# EAGLE design Kernal64Cart (EAGLE 9.5.2)
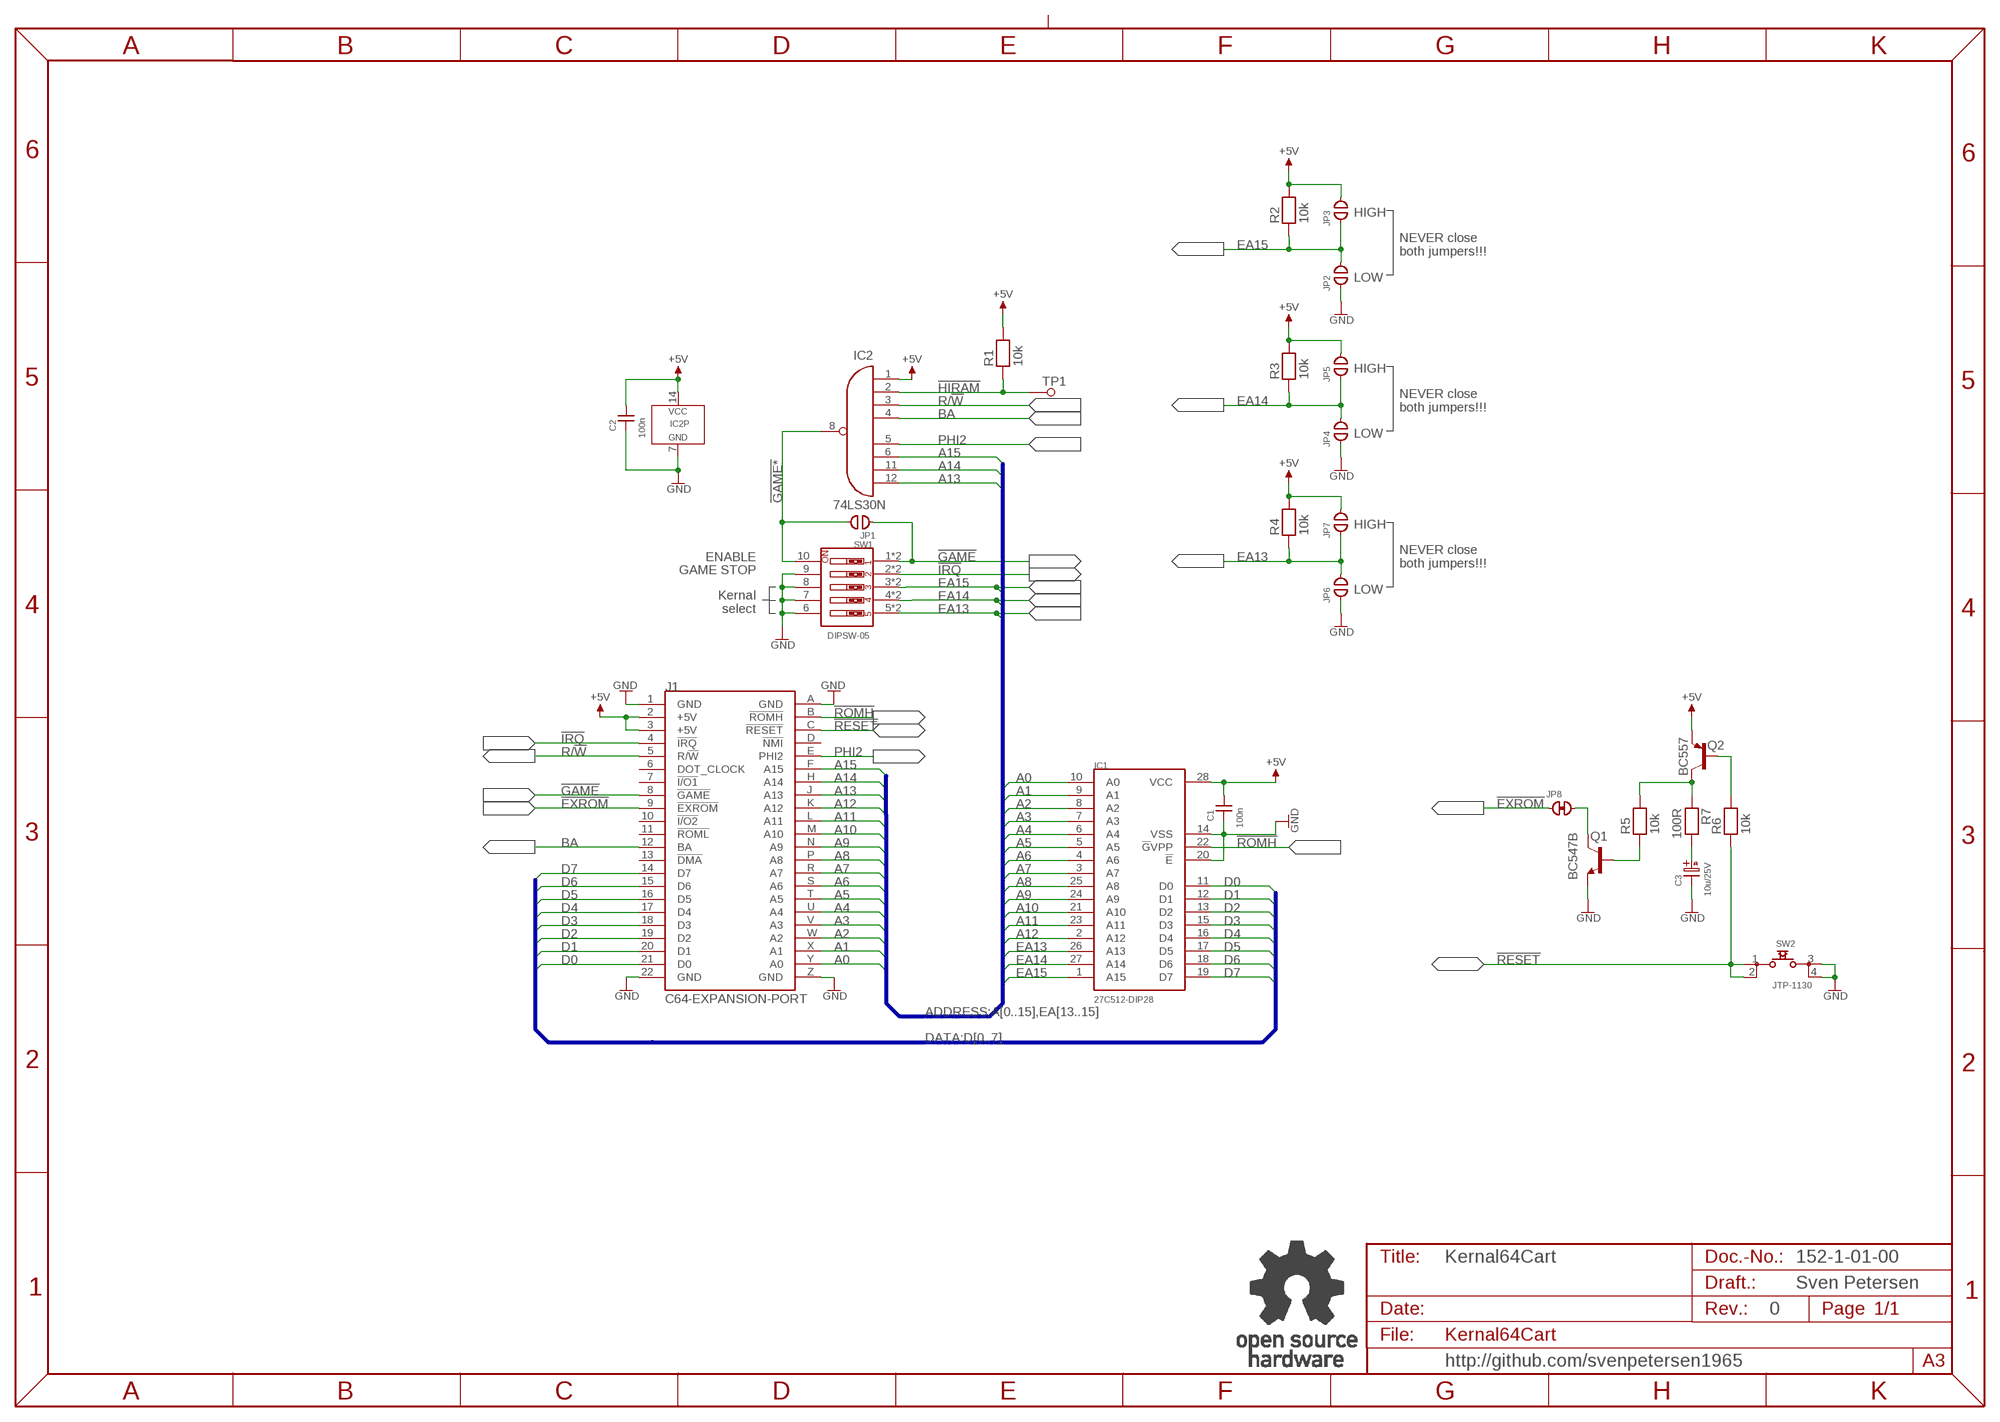
[diagram p0: schematic, sheet 1]

## Parts
C1  100n  CAP01  [C-2,5]
C2  100n  CAP01  [C-2,5]
C3  10u/25V  C05,0/2,0  [C5,0/2,0]
IC1  27C512-DIP28  M27C512-DIP28  [DIL28-6]
IC2  74LS30N  7430DIP  [DIL-14]
J1  C64-EXPANSION-PORT  C64-EXPANSIONPNARROW  [EXPANSIO_SQ]
JP1  OPEN  [CP_OP]
JP2  OPEN  [CP_OP]
JP3  OPEN  [CP_OP]
JP4  OPEN  [CP_OP]
JP5  OPEN  [CP_OP]
JP6  OPEN  [CP_OP]
JP7  OPEN  [CP_OP]
JP8  CLOSED  [CP_CL]
Q1  BC547B  [TO92]
Q2  BC557  [TO92]
R1  10k  RES04  [R-10]
R2  10k  RES04  [R-10]
R3  10k  RES04  [R-10]
R4  10k  RES04  [R-10]
R5  10k  RES04  [R-10]
R6  10k  RES04  [R-10]
R7  100R  RES04  [R-10]
SW1  DIPSW-05  [DIPSW-05VJ]
SW2  JTP-1130  [JTP-1130]
TP1  1,3/2,0  [1,3/2,0]
U$50  OPEN_SOURCE_HW  [OPENHW]

## Nets
!EXROM: J1.9(!EXROM) JP8.1
!GAME: J1.8(!GAME) JP1.1 SW1.1 SW1.1J
!GAME*: IC2.8(O) JP1.2 SW1.10
!HIRAM: IC2.2(I1) R1.1 TP1.1
!IRQ: J1.4(!IRQ) SW1.2 SW1.2J
!RESET: J1.C(!RESET) R6.1 SW2.1 SW2.2
!ROMH: IC1.22(!G!VPP) J1.B(!ROMH)
+5V: C1.2 C2.2 IC1.28(VCC) IC2.1(I0) IC2.14(VCC) J1.2(+5V) J1.3(+5V) JP3.2 JP5.2 JP7.2 Q2.1(E) R1.2 R2.2 R3.2 R4.2
A0: IC1.10(A0) J1.Y(A0)
A1: IC1.9(A1) J1.X(A1)
A2: IC1.8(A2) J1.W(A2)
A3: IC1.7(A3) J1.V(A3)
A4: IC1.6(A4) J1.U(A4)
A5: IC1.5(A5) J1.T(A5)
A6: IC1.4(A6) J1.S(A6)
A7: IC1.3(A7) J1.R(A7)
A8: IC1.25(A8) J1.P(A8)
A9: IC1.24(A9) J1.N(A9)
A10: IC1.21(A10) J1.M(A10)
A11: IC1.23(A11) J1.L(A11)
A12: IC1.2(A12) J1.K(A12)
A13: IC2.12(I7) J1.J(A13)
A14: IC2.11(I6) J1.H(A14)
A15: IC2.6(I5) J1.F(A15)
BA: IC2.4(I3) J1.12(BA)
D0: IC1.11(D0) J1.21(D0)
D1: IC1.12(D1) J1.20(D1)
D2: IC1.13(D2) J1.19(D2)
D3: IC1.15(D3) J1.18(D3)
D4: IC1.16(D4) J1.17(D4)
D5: IC1.17(D5) J1.16(D5)
D6: IC1.18(D6) J1.15(D6)
D7: IC1.19(D7) J1.14(D7)
EA13: IC1.26(A13) JP6.2 JP7.1 R4.1 SW1.5 SW1.5J
EA14: IC1.27(A14) JP4.2 JP5.1 R3.1 SW1.4 SW1.4J
EA15: IC1.1(A15) JP2.2 JP3.1 R2.1 SW1.3 SW1.3J
GND: C1.1 C2.1 C3.K(-) IC1.14(VSS) IC1.20(!E) IC2.7(GND) J1.1(GND) J1.22(GND) J1.A(GND) J1.Z(GND) JP2.1 JP4.1 JP6.1 Q1.1(E) SW1.6 SW1.7 SW1.8 SW1.9 SW2.3 SW2.4
N$1: JP8.2 Q1.3(C)
N$2: Q1.2(B) R5.1
N$3: Q2.2(B) R6.2
N$4: Q2.3(C) R5.2 R7.1
N$5: C3.A(+) R7.2
PHI2: IC2.5(I4) J1.E(PHI2)
R/!W: IC2.3(I2) J1.5(R/!W)
Unconnected: J1.6(DOT_CLOCK) J1.7(!I/O1) J1.10(!I/O2) J1.11(!ROML) J1.13(!DMA) J1.D(!NMI)

## Buses
DATA:D[0..7]
ADDRESS:A[0..15],EA[13..15]

## Notes on the sheet
- HIGH
- NEVER close
  both jumpers!!!
- LOW
- HIGH
- NEVER close
  both jumpers!!!
- LOW
- HIGH
- ENABLE
- NEVER close
  both jumpers!!!
- GAME STOP
- LOW
- Kernal
  select
- Kernal64Cart | 152-1-01-00
- Sven Petersen
- 0
- http://github.com/svenpetersen1965

## Library data of the parts
C1 C2 = DISCRETE:CAP01
C3 = ELCO:C05,0/2,0
IC1 = ST:M27C512
IC2 = 74XX:7430
J1 = Commodore:C64-EXPANSIONP
JP1-JP7 = Cutpad:OPEN: open Cutpad
JP8 = Cutpad:CLOSED: Closed Cutpad
Q1 = Transistoren:BC547*: NPN Transistor
Q2 = Transistoren:BC557: PNP Transistor
R1-R7 = DISCRETE:RES04
SW1 = DIPSWITCH:DIPSW-05
SW2 = Namae_Electronics:JTP-1130
TP1 = Pads:1,3/2,0: Testpunkt Typ: 13.70.635 Hersteller: Ettinger Technologie: Einpresstechnik Bauform: - erzeugt von: C. Zellner am: 13.3.2015 letzte Änderung: - Eagle-Version: 6.5.0
U$50 = Logo:OPEN_SOURCE_HW

## Board
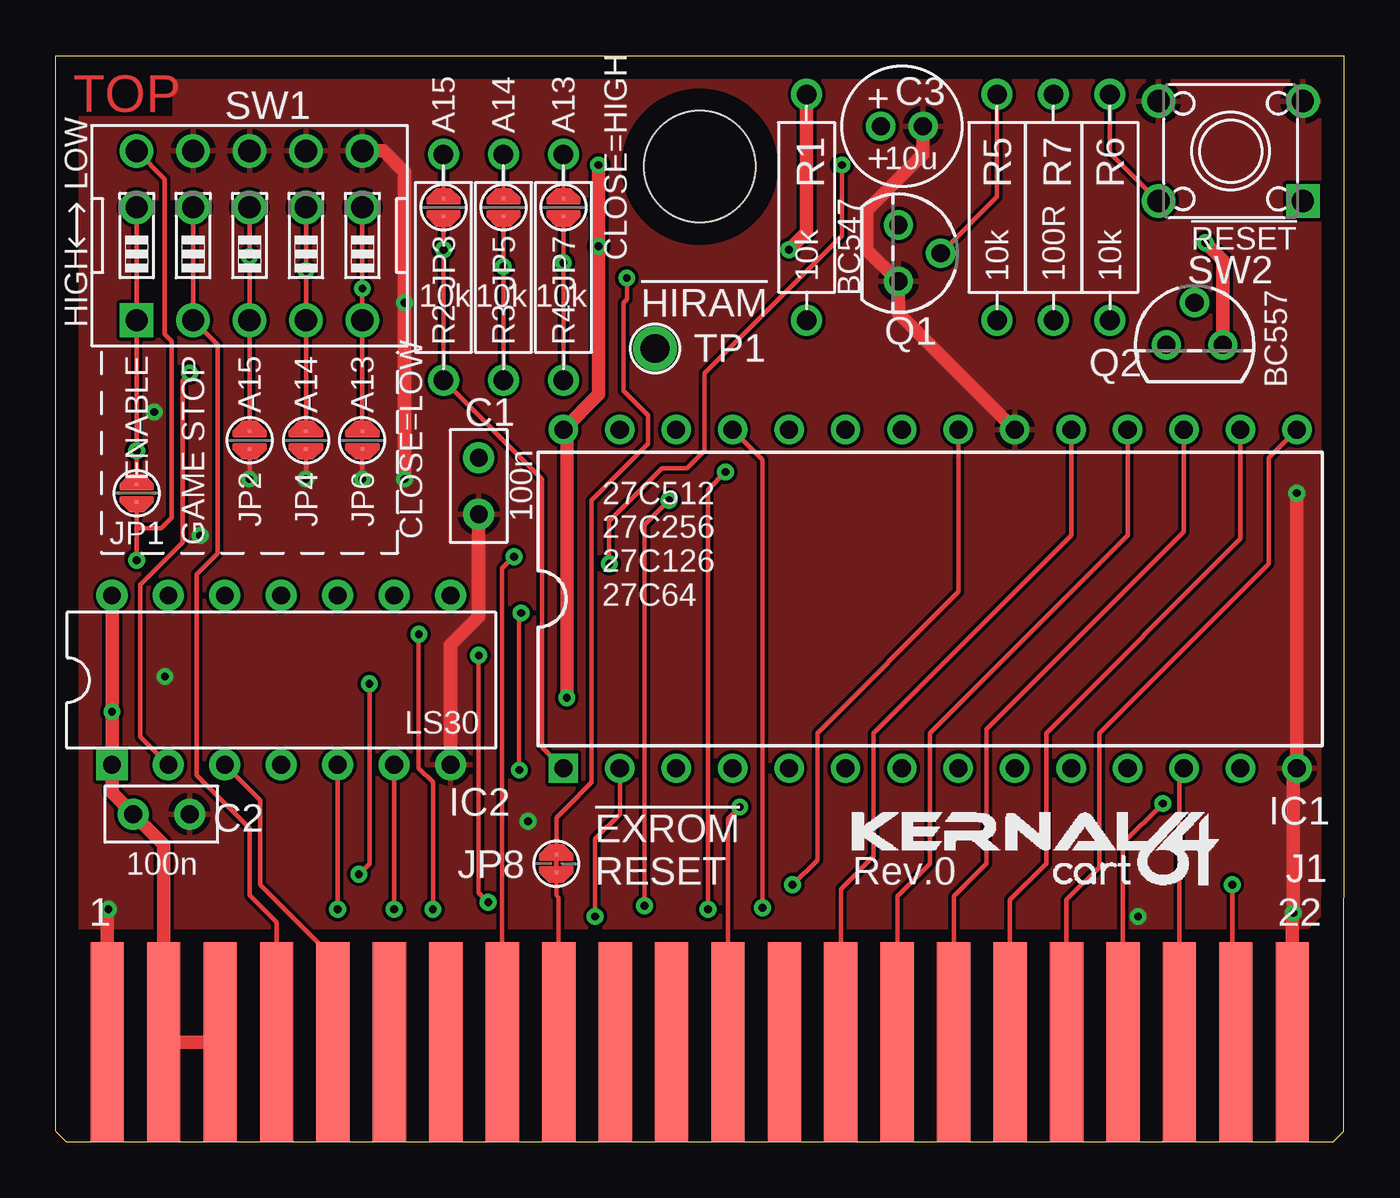
[diagram p1: board, top side]
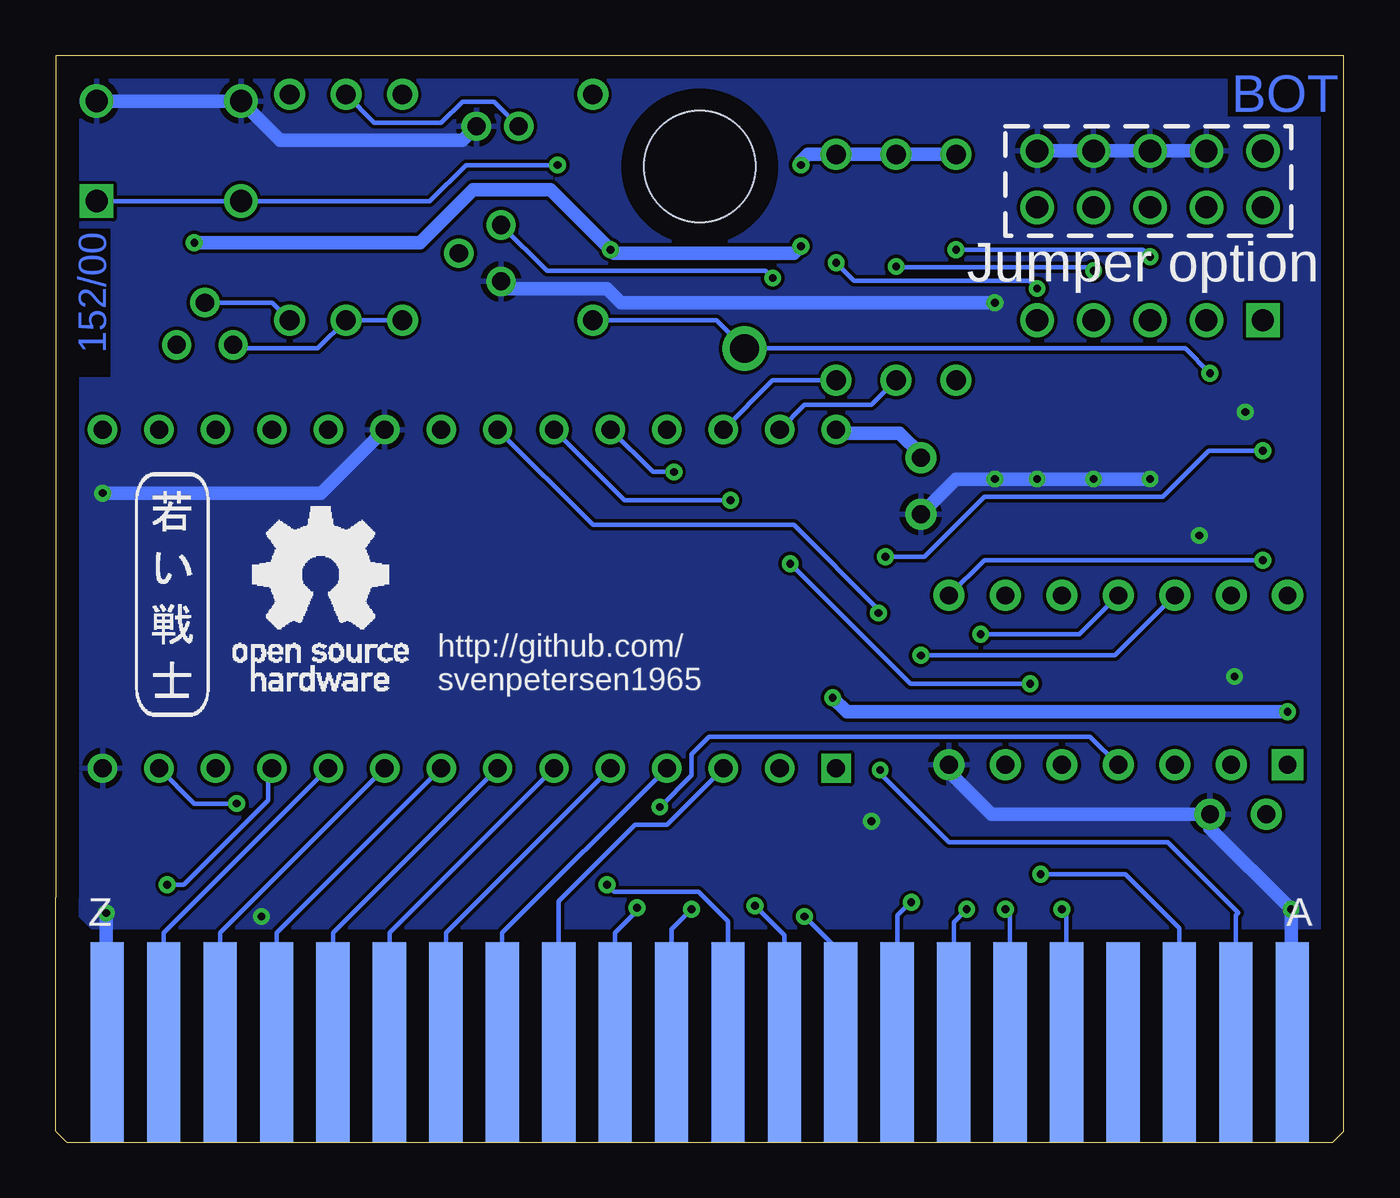
[diagram p2: board, bottom side, seen from below]

Size 58 x 48.9 mm. Coordinates in mm from the lower left corner, seen from the top.
Outline: 0,11 0,48.9 58,48.9 58,11
Copper layers (1*16): Top 0.035mm / dielectric 1.5mm / Bottom 0.035mm
Design rules "default *": minimum track width 6mil, minimum drill 0.35mm, track to track 6mil, track to pad 6mil, pad to pad 6mil, via to via 6mil, smd to smd 6mil, copper to edge 40mil, drill to drill 6mil, minimum pad ring 10mil, minimum via ring 8mil, stop-mask expansion 4mil, vias tented up to drill 24mil, thermal gap 10mil
Holes 5 mm at 29,43.9
bRestrict: 3 lines

### Footprints (pad centres in the part's own frame; a part is rotated, then mirrored left to right if it is on the bottom)
C-2,5 = drill 0.8 pad 1.397: 1 -1.27,0; 2 1.27,0
C5,0/2,0 = drill 0.813 pad 1.27: A -0.953,0; K 0.953,0
DIL28-6 = drill 0.813 square: 1 -16.51,-7.62 | drill 0.813: 2 -13.97,-7.62; 3 -11.43,-7.62; 4 -8.89,-7.62; 5 -6.35,-7.62; 6 -3.81,-7.62; 7 -1.27,-7.62; 8 1.27,-7.62; 9 3.81,-7.62; 10 6.35,-7.62; 11 8.89,-7.62; 12 11.43,-7.62; 13 13.97,-7.62; 14 16.51,-7.62; 15 16.51,7.62; 16 13.97,7.62; 17 11.43,7.62; 18 8.89,7.62; 19 6.35,7.62; 20 3.81,7.62; 21 1.27,7.62; 22 -1.27,7.62; 23 -3.81,7.62; 24 -6.35,7.62; 25 -8.89,7.62; 26 -11.43,7.62; 27 -13.97,7.62; 28 -16.51,7.62
DIL-14 = drill 0.8 pad 1.397 square: 1 -7.62,-3.81 | drill 0.8 pad 1.397: 2 -5.08,-3.81; 3 -2.54,-3.81; 4 0,-3.81; 5 2.54,-3.81; 6 5.08,-3.81; 7 7.62,-3.81; 8 7.62,3.81; 9 5.08,3.81; 10 2.54,3.81; 11 0,3.81; 12 -2.54,3.81; 13 -5.08,3.81; 14 -7.62,3.81
EXPANSIO_SQ = smd 1.5 x 9: 1 26.67,-4.5; 2 24.13,-4.5; 3 21.59,-4.5; 4 19.05,-4.5; 5 16.51,-4.5; 6 13.97,-4.5; 7 11.43,-4.5; 8 8.89,-4.5; 9 6.35,-4.5; 10 3.81,-4.5; 11 1.27,-4.5; 12 -1.27,-4.5; 13 -3.81,-4.5; 14 -6.35,-4.5; 15 -8.89,-4.5; 16 -11.43,-4.5; 17 -13.97,-4.5; 18 -16.51,-4.5; 19 -19.05,-4.5; 20 -21.59,-4.5; 21 -24.13,-4.5; 22 -26.67,-4.5 | smd 1.5 x 9 bottom: A 26.67,-4.5; B 24.13,-4.5; C 21.59,-4.5; D 19.05,-4.5; E 16.51,-4.5; F 13.97,-4.5; H 11.43,-4.5; J 8.89,-4.5; K 6.35,-4.5; L 3.81,-4.5; M 1.27,-4.5; N -1.27,-4.5; P -3.81,-4.5; R -6.35,-4.5; S -8.89,-4.5; T -11.43,-4.5; U -13.97,-4.5; V -16.51,-4.5; W -19.05,-4.5; X -21.59,-4.5; Y -24.13,-4.5; Z -26.67,-4.5
CP_OP = smd 0.152 x 0.152: 1 -0.4,0; 2 0.4,0
CP_CL = smd 0.152 x 0.152: 1 -0.4,0; 2 0.4,0
TO92 = drill 0.813: 1 1.27,0; 2 0,1.905; 3 -1.27,0
R-10 = drill 0.889 pad 1.397: 1 -5.08,0; 2 5.08,0
DIPSW-05VJ = drill 1 square: 1 -5.08,-3.81 | drill 1: 1J -5.08,1.27; 2 -2.54,-3.81; 2J -2.54,1.27; 3 0,-3.81; 3J 0,1.27; 4 2.54,-3.81; 4J 2.54,1.27; 5 5.08,-3.81; 5J 5.08,1.27; 6 5.08,3.81; 7 2.54,3.81; 8 0,3.81; 9 -2.54,3.81; 10 -5.08,3.81
JTP-1130 = drill 1 square: 1 3.25,-2.25 | drill 1: 2 -3.25,-2.25; 3 3.25,2.25; 4 -3.25,2.25
1,3/2,0 = drill 1.3 pad 2: 1 0,0

### Placement (x,y rotation side)
C1  19.05,29.53 90 top
C2  4.76,14.76 180 top
C3  38.1,45.72 0 top
IC1  39.37,24.45 0 top
IC2  10.16,20.8 0 top
J1  29,0 180 top
JP1  3.65,29.21 270 top
JP2  8.73,31.59 90 top
JP3  17.46,42.07 90 top
JP4  11.27,31.59 90 top
JP5  20.16,42.07 90 top
JP6  13.81,31.59 90 top
JP7  22.86,42.07 90 top
JP8  22.54,12.54 90 top
Q1  37.94,40.01 270 top
Q2  51.28,35.88 0 top
R1  33.81,42.07 90 top
R2  17.46,39.37 90 top
R3  20.16,39.37 90 top
R4  22.86,39.37 90 top
R5  42.39,42.07 270 top
R6  47.47,42.07 270 top
R7  44.93,42.07 90 top
SW1  8.73,40.8 0 top
SW2  52.9,44.6 0 top
TP1  26.99,35.72 0 top
U$39  [KERNAL64CART]  35.88,11.59 0 top
U$40  [2LAYER]  0.79,46.35 0 top
U$41  [PCB-TITLE/]  0,60.96 0 top  (outside the outline)
U$42  [SVEN_TAG]  52.7,24.77 0 bottom
U$50  50.01,20.32 0 bottom

### Tracks (layer width: path | path; a pad name or v marks a point on that pad's centre or on a via)
!EXROM
  Top 0.203: J1.9 22.65,11.01 22.54,11.11 JP8.1
!GAME  (via drill 0.35)
  Top 0.203: JP1.1 v3.65,31.11 SW1.1 SW1.1J | J1.8 20.11,25.82 v20.64,26.35
  Bottom 0.203: v20.64,26.35 18.89,26.35 16.19,29.05 8.15,29.05 6.09,31.11 v3.65,31.11
!GAME*  (via drill 0.35)
  Top 0.203: JP1.2 3.65,27.62 | 3.65,27.62 3.65,27.3 v3.65,26.19 | SW1.10 4.92,43.34 4.92,36.35 5.24,36.04 5.24,28.1 4.76,27.62 3.65,27.62
  Bottom 0.203: IC2.8 16.19,26.19 v3.65,26.19
!HIRAM  (via drill 0.35)
  Top 0.203: IC2.2 3.81,18.26 3.81,25.08 5.71,26.99 5.71,34.29 v6.03,34.61
  Bottom 0.203: R1.1 28.26,36.99 TP1.1 7.14,35.72 v6.03,34.61
!IRQ
  Top 0.203: SW1.2J SW1.2 7.3,35.88 7.3,26.51 6.35,25.56 6.35,16.51 8.73,14.13 8.73,11.11 9.95,9.89 J1.4
!RESET  (via drill 0.35)
  Top 0.203: SW2.2 47.47,44.53 R6.1 | v13.65,12.06 14.13,12.54 v14.13,20.64 | v24.92,26.04 24.92,27.94 27.3,30.32 28.42,30.32 29.21,31.11 29.21,34.61 35.4,40.8 v35.4,43.97
  Bottom 0.203: SW2.1 SW2.2 41.15,42.35 39.53,43.97 v35.4,43.97 | J1.C 7.41,9.63 9.84,12.06 v13.65,12.06 | v14.13,20.64 19.53,20.64 v24.92,26.04
!ROMH  (via drill 0.35)
  Top 0.203: v20.88,16.75 20.88,23.73 v20.95,23.81
  Bottom 0.203: J1.B 4.87,10.21 4.76,10.32 7.94,13.49 17.78,13.49 20.95,16.67 v20.88,16.75 | v20.95,23.81 20.95,23.97 24.77,27.78 33.81,27.78 IC1.22
+5V  (via drill 0.35)
  Top 0.203: JP3.2 R2.2 | JP5.2 R3.2 | JP7.2 R4.2
  Top 0.61: v24.45,43.97 v24.45,40.32 24.45,33.66 IC1.28 23.02,31.91 v23.02,20 | v33.02,40.16 33.81,40.96 R1.2 | IC2.14 v2.54,19.37 IC2.1 2.54,15.72 C2.2 4.87,13.39 J1.2 J1.3 | v51.75,40.48 52.55,39.69 Q2.1
  Bottom 0.61: R2.2 R3.2 R4.2 24.13,44.45 24.45,44.13 v24.45,43.97 | v24.45,40.32 24.77,40.01 32.86,40.01 v33.02,40.16 35.72,42.86 39.21,42.86 41.59,40.48 v51.75,40.48 | IC1.28 22.7,31.91 20,31.91 19.05,30.96 C1.2 | v2.54,19.37 22.38,19.37 v23.02,20
A0
  Bottom 0.203: J1.Y 53.13,9.42 IC1.10
A1
  Bottom 0.203: J1.X 50.59,9.42 IC1.9
A2
  Bottom 0.203: J1.W 48.05,9.42 IC1.8
A3
  Bottom 0.203: J1.V 45.51,9.42 IC1.7
A4
  Bottom 0.203: J1.U 42.97,9.42 IC1.6
A5
  Bottom 0.203: J1.T 40.43,9.42 IC1.5
A6
  Bottom 0.203: J1.S 37.89,9.42 IC1.4
A7
  Bottom 0.203: J1.R 35.35,10.85 31.91,14.29 30.48,14.29 IC1.3
A8  (via drill 0.35)
  Top 0.203: v31.83,10.56 31.83,30.72 IC1.25
  Bottom 0.203: J1.P 32.81,9.42 31.75,10.48 v31.83,10.56
A9  (via drill 0.35)
  Top 0.203: v29.37,10.48 29.37,29.37 v30.16,30.16
  Bottom 0.203: J1.N 30.27,9.58 v29.37,10.48 | v30.16,30.16 31.11,30.16 IC1.24
A10  (via drill 0.35)
  Top 0.203: v33.18,11.59 34.29,12.7 34.29,18.41 40.64,24.77 IC1.21
  Bottom 0.203: J1.M 27.73,9.95 29.05,11.27 32.86,11.27 v33.18,11.59
A11  (via drill 0.35)
  Top 0.203: v26.51,10.64 26.51,27.78 v27.62,28.89
  Bottom 0.203: J1.L 25.19,9.31 v26.51,10.64 | v27.62,28.89 32.38,28.89 IC1.23
A12  (via drill 0.35)
  Top 0.203: v24.29,10.16 24.29,13.65 25.4,14.76 IC1.2
  Bottom 0.203: J1.K 22.65,8.52 v24.29,10.16
A13  (via drill 0.35)
  Top 0.203: v19.48,10.79 19.05,11.22 v19.05,21.91
  Bottom 0.203: J1.J 20.11,10.21 19.53,10.79 v19.48,10.79 | v19.05,21.91 10.32,21.91 IC2.12
A14  (via drill 0.35)
  Top 0.203: v16.99,10.48 16.99,16.19 16.35,16.83 v16.35,22.86
  Bottom 0.203: J1.H 17.57,9.89 v16.99,10.48 | v16.35,22.86 11.91,22.86 IC2.11
A15  (via drill 0.35)
  Top 0.203: v15.24,10.48 IC2.6
  Bottom 0.203: J1.F 15.03,10.27 v15.24,10.48
BA  (via drill 0.35)
  Top 0.203: J1.12 30.27,14.55 v30.8,15.08
  Bottom 0.203: v30.8,15.08 29.37,16.51 29.37,17.46 28.57,18.26 11.43,18.26 IC2.4
D0  (via drill 0.35)
  Top 0.203: v52.97,11.59 52.97,4.66 J1.21
  Bottom 0.203: IC1.11 48.42,16.67 48.42,15.4 52.23,11.59 v52.97,11.59 | v52.97,11.59 53.02,11.59 v52.97,11.59
D1
  Top 0.203: J1.20 50.59,16.62 IC1.12
D2  (via drill 0.35)
  Top 0.203: J1.19 48.05,13.44 v49.85,15.24
  Bottom 0.203: v49.85,15.24 51.75,15.24 IC1.13
D3
  Top 0.203: J1.18 45.51,10.9 46.99,12.38 46.99,18.41 54.61,26.04 54.61,30.8 IC1.15
D4
  Top 0.203: J1.17 42.97,10.9 44.61,12.54 44.61,18.41 53.34,27.15 IC1.16
D5
  Top 0.203: J1.16 40.43,11.06 41.91,12.54 41.91,18.57 50.8,27.46 IC1.17
D6
  Top 0.203: J1.15 37.89,11.06 39.37,12.54 39.37,18.41 48.26,27.3 IC1.18
D7
  Top 0.203: J1.14 35.35,11.38 36.83,12.86 36.83,18.41 45.72,27.3 IC1.19
EA13  (via drill 0.35)
  Top 0.203: JP6.2 SW1.5 v13.81,38.42 SW1.5J | JP7.1 v22.86,39.57 R4.1
  Bottom 0.203: IC1.26 25.72,34.29 R4.1 | v22.86,39.57 22.07,38.78 14.17,38.78 v13.81,38.42
EA14  (via drill 0.35)
  Top 0.203: JP4.2 SW1.4 v11.27,39.21 SW1.4J | JP5.1 v20.16,39.41 R3.1
  Bottom 0.203: IC1.27 24.29,33.18 21.27,33.18 R3.1 | v11.27,39.21 11.43,39.37 20.12,39.37 v20.16,39.41
EA15  (via drill 0.35)
  Top 0.203: JP2.2 SW1.3 v8.73,39.85 SW1.3J | JP3.1 v17.46,40.16 R2.1 21.91,29.84 21.91,17.78 IC1.1
  Bottom 0.203: v17.46,40.16 9.05,40.16 v8.73,39.85
GND  (via drill 0.35)
  Top 0.203: v8.73,29.84 JP2.1 | v11.27,29.84 JP4.1 | v13.81,29.84 JP6.1
  Top 0.61: v15.72,29.84 15.72,37.62 v15.72,37.78 15.72,43.66 14.76,44.61 SW1.6 | J1.A 2.33,10.43 v2.38,10.48 | IC2.7 17.78,22.38 19.05,23.65 C1.1 | C3.K 39.05,44.45 36.51,41.91 36.51,40.16 Q1.1 37.94,37.31 IC1.20 | J1.22 55.67,10.27 v55.72,10.32 55.72,16.67 IC1.14 v55.88,29.21
  Bottom 0.61: SW1.9 SW1.8 SW1.7 SW1.6 | v8.73,29.84 v11.27,29.84 v13.81,29.84 v15.72,29.84 17.46,29.84 C1.1 | J1.A 2.38,4.55 v2.38,10.48 6.03,14.13 C2.1 15.88,14.76 17.78,16.67 IC2.7 | SW2.3 SW2.4 47.88,45.09 39.69,45.09 C3.K | Q1.1 37.62,38.42 37.47,38.42 33.18,38.42 32.54,37.78 v15.72,37.78 | v55.72,10.32 55.72,4.55 J1.22 | v55.88,29.21 46.04,29.21 IC1.20
  other vias: 4.92,20.95 21.27,14.45 48.74,10.16 6.51,27.3 4.45,32.86
  pour Top: 0.64,48.26 0.64,10 0.95,9.68 56.36,9.68 57.15,10.48 57.15,48.26
  pour Bottom: 0.64,48.26 0.64,10 0.95,9.68 56.36,9.68 57.15,10.48 57.15,48.26
N$1  (via drill 0.35)
  Top 0.203: v25.72,38.89 25.72,37.94 25.56,37.78 25.56,33.81 26.67,32.7 26.67,31.43 24.13,28.89 24.13,16.19 23.02,15.08 22.54,14.61 JP8.2
  Bottom 0.203: Q1.3 35.88,39.21 26.04,39.21 v25.72,38.89
N$2
  Top 0.203: Q1.2 42.39,42.55 R5.1
N$3
  Bottom 0.203: R6.2 48.26,37.78 Q2.2
N$4
  Bottom 0.203: Q2.3 49.85,35.72 46.2,35.72 R7.1 R5.2
N$5
  Bottom 0.203: R7.2 43.66,45.88 40.64,45.88 39.69,46.83 38.26,46.83 C3.A
PHI2  (via drill 0.35)
  Top 0.203: v12.7,10.48 IC2.5
  Bottom 0.203: J1.E 12.49,10.27 v12.7,10.48
R/!W
  Top 0.203: J1.5 12.49,8.31 9.21,11.59 9.21,15.4 IC2.3

### Text on the board
Bottom: 152/00
tPlace: A15 | A14 | A13 | 10u | LOW | CLOSE=HIGH | !RESET | 10k | 10k | 100R | 10k | 10k | 10k | 10k | BC547 | HIGH | !HIRAM | ENABLE | GAME STOP | A15 | A14 | A13 | BC557 | 100n | CLOSE=LOW | 27C512 / 27C256 / 27C126 / 27C64 | LS30 | 100n | !EXROM / RESET | Rev.0
bPlace: Jumper option | http://github.com/ / svenpetersen1965
Measures: 5.0
Document: 152-2-01-00 | Sven Petersen / 2020 | 35µm | 2 | 0